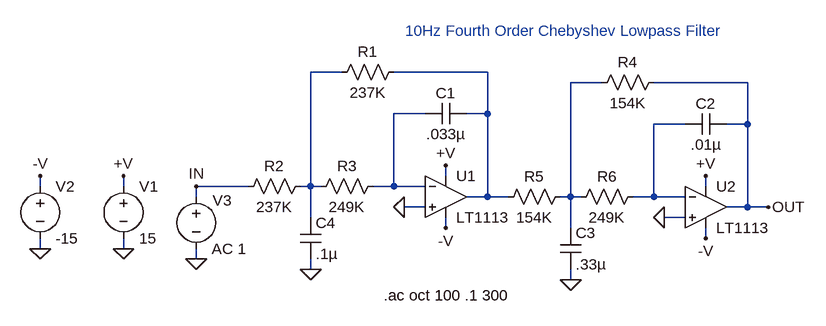
[diagram p0: schematic 1113.asc]
1113.asc, the LTspice schematic file:
Version 4
SHEET 1 924 680
WIRE 144 32 96 32
WIRE 368 32 224 32
WIRE 544 48 496 48
WIRE 768 48 624 48
WIRE 272 96 224 96
WIRE 368 96 368 32
WIRE 368 96 336 96
WIRE 672 112 624 112
WIRE 768 112 768 48
WIRE 768 112 736 112
WIRE 304 192 304 176
WIRE -320 208 -320 192
WIRE -192 208 -192 192
WIRE 0 208 -80 208
WIRE 96 208 96 32
WIRE 96 208 80 208
WIRE 112 208 96 208
WIRE 224 208 224 96
WIRE 224 208 192 208
WIRE 272 208 224 208
WIRE 704 208 704 192
WIRE -80 224 -80 208
WIRE 368 224 368 96
WIRE 368 224 336 224
WIRE 400 224 368 224
WIRE 496 224 496 48
WIRE 496 224 480 224
WIRE 512 224 496 224
WIRE 624 224 624 112
WIRE 624 224 592 224
WIRE 672 224 624 224
WIRE 272 240 240 240
WIRE 768 240 768 112
WIRE 768 240 736 240
WIRE 800 240 768 240
WIRE 96 256 96 208
WIRE 672 256 640 256
WIRE 304 272 304 256
WIRE 496 272 496 224
WIRE 704 288 704 272
WIRE -320 304 -320 288
WIRE -192 304 -192 288
WIRE -80 320 -80 304
WIRE 96 336 96 320
WIRE 496 352 496 336
FLAG -192 304 0
FLAG 304 176 +V
FLAG -192 192 +V
FLAG 304 272 -V
FLAG -320 304 0
FLAG -320 192 -V
FLAG -80 320 0
FLAG 240 240 0
FLAG 704 192 +V
FLAG 704 288 -V
FLAG 640 256 0
FLAG 496 352 0
FLAG 96 336 0
FLAG 800 240 OUT
FLAG -80 208 IN
SYMBOL voltage -192 192 R0
SYMATTR InstName V1
SYMATTR Value 15
SYMBOL voltage -320 192 R0
SYMATTR InstName V2
SYMATTR Value -15
SYMBOL res 240 16 R90
WINDOW 0 0 56 VBottom 2
WINDOW 3 32 56 VTop 2
SYMATTR InstName R1
SYMATTR Value 237K
SYMBOL res 96 192 R90
WINDOW 0 0 56 VBottom 2
WINDOW 3 32 56 VTop 2
SYMATTR InstName R2
SYMATTR Value 237K
SYMBOL voltage -80 208 R0
WINDOW 0 25 22 Left 2
SYMATTR InstName V3
SYMATTR Value AC 1
SYMBOL opamps\\LT1113 304 160 R0
SYMATTR InstName U1
SYMBOL res 208 192 R90
WINDOW 0 0 56 VBottom 2
WINDOW 3 32 56 VTop 2
SYMATTR InstName R3
SYMATTR Value 249K
SYMBOL cap 336 80 R90
WINDOW 0 0 32 VBottom 2
WINDOW 3 32 32 VTop 2
SYMATTR InstName C1
SYMATTR Value .033µ
SYMBOL res 640 32 R90
WINDOW 0 0 56 VBottom 2
WINDOW 3 32 56 VTop 2
SYMATTR InstName R4
SYMATTR Value 154K
SYMBOL res 496 208 R90
WINDOW 0 0 56 VBottom 2
WINDOW 3 32 56 VTop 2
SYMATTR InstName R5
SYMATTR Value 154K
SYMBOL opamps\\LT1113 704 176 R0
SYMATTR InstName U2
SYMBOL res 608 208 R90
WINDOW 0 0 56 VBottom 2
WINDOW 3 32 56 VTop 2
SYMATTR InstName R6
SYMATTR Value 249K
SYMBOL cap 736 96 R90
WINDOW 0 0 32 VBottom 2
WINDOW 3 32 32 VTop 2
SYMATTR InstName C2
SYMATTR Value .01µ
SYMBOL cap 480 272 R0
SYMATTR InstName C3
SYMATTR Value .33µ
SYMBOL cap 80 256 R0
SYMATTR InstName C4
SYMATTR Value .1µ
TEXT 208 376 Left 2 !.ac oct 100 .1 300
TEXT 488 -16 Bottom 2 ;10Hz Fourth Order Chebyshev Lowpass Filter

The netlist it stands for:
* 1113.asc
V1 +V 0 15
V2 -V 0 -15
R1 N002 N001 237K
R2 N001 IN 237K
V3 IN 0 AC 1
XU1 0 N004 +V -V N002 LT1113  ; pins In+ In- V+ V- OUT
R3 N004 N001 249K
C1 N002 N004 .033µ
R4 OUT N003 154K
R5 N003 N002 154K
XU2 0 N005 +V -V OUT LT1113  ; pins In+ In- V+ V- OUT
R6 N005 N003 249K
C2 OUT N005 .01µ
C3 N003 0 .33µ
C4 N001 0 .1µ
.ac oct 100 .1 300
* 10Hz Fourth Order Chebyshev Lowpass Filter
.backanno
.end